# Altium schematic sheet USB Comms.SchDoc: Ravage - USB Comms
size A4; Address1: Drawn By:; Address2: Dan Visser; DocumentNumber: A; Revision: 0.1-alpha; SheetNumber: 3; SheetTotal: 16
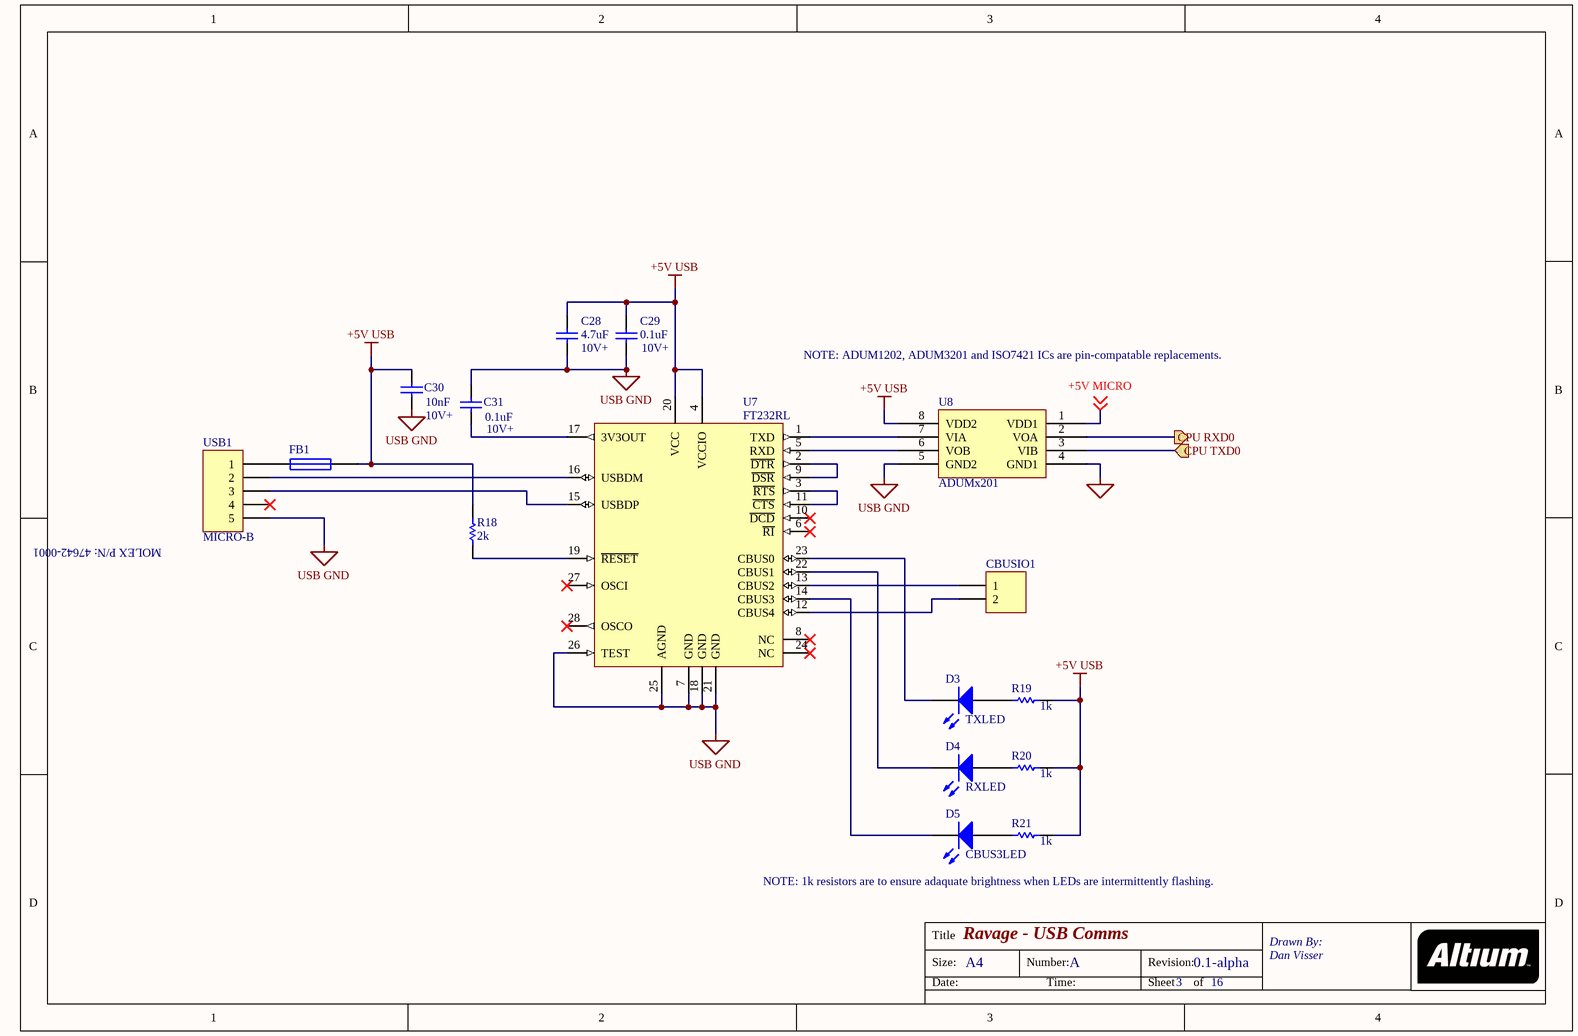
[diagram p0: USB Comms.SchDoc]

## Parts
C28  value 4.7uF  [RAD-0.3]
C29  value 0.1uF  [RAD-0.3]
C30  value 10nF  [RAD-0.3]
C31  value 0.1uF  [RAD-0.3]
CBUSIO1  (no value)  [HDR1X2]
D3  TXLED  [LED-0]
D4  RXLED  [LED-0]
D5  CBUS3LED  [LED-0]
FB1  (no value)  [PIN-W2/E2.8]
R18  value 2k  [AXIAL-0.3]
R19  value 1k  [AXIAL-0.3]
R20  value 1k  [AXIAL-0.3]
R21  value 1k  [AXIAL-0.3]
U7  FT232RL  [SSOP-28_M]
U8  ADUMx201
USB1  MICRO-B  [HDR1X5]

## Ports
CPU RXD0 (out), CPU TXD0 (in)

## Nets
+5V USB: C28.2 C29.2 C30.2 FB1.2 R18.2 R19.2 R20.2 R21.2 U7.4(VCCIO) U7.20(VCC) U8.8(VDD2)
USB GND: C28.1 C29.1 C30.1 C31.2 U7.7(GND) U7.18(GND) U7.21(GND) U7.25(AGND) U7.26(TEST) U8.5(GND2) USB1.5
+5V MICRO: U8.1(VDD1) ; off-sheet +5V MICRO
CPU RXD0: U8.2(VOA) ; port CPU RXD0
CPU TXD0: U8.3(VIB) ; port CPU TXD0
NetC31_1: C31.1 U7.17(3V3OUT)
NetCBUSIO1_1: CBUSIO1.1 U7.13(CBUS2)
NetCBUSIO1_2: CBUSIO1.2 U7.12(CBUS4)
NetD3_1: D3.1(A) R19.1
NetD3_2: D3.2(K) U7.23(CBUS0)
NetD4_1: D4.1(A) R20.1
NetD4_2: D4.2(K) U7.22(CBUS1)
NetD5_1: D5.1(A) R21.1
NetD5_2: D5.2(K) U7.14(CBUS3)
NetR18_1: R18.1 U7.19(~{RESET})
NetU7_1: U7.1(TXD) U8.7(VIA)
NetU7_2: U7.2(~{DTR}) U7.9(~{DSR})
NetU7_3: U7.3(~{RTS}) U7.11(~{CTS})
NetU7_5: U7.5(RXD) U8.6(VOB)
NetU7_15: U7.15(USBDP) USB1.3
NetU7_16: U7.16(USBDM) USB1.2

Not connected (* = marked no-connect by the designer): FB1 1; U7 6(~{RI})* 8(NC)* 10(~{DCD})* 24(NC)* 27(OSCI)* 28(OSCO)*; U8 4(GND1); USB1 1 4*

## Notes on the sheet
- 10V+
- (near C29) 10V+
- NOTE: ADUM1202, ADUM3201 and ISO7421 ICs are pin-compatable replacements.
- (near C31) 10V+
- (near USB1) MOLEX P/N: 47642-0001
- NOTE: 1k resistors are to ensure adaquate brightness when LEDs are intermittently flashing.
- Title
- Size:
- Date:
- A4
- Number:
- Time:
- Revision:
- Sheet
- of

## Library data of the parts
C28-C31 = Cap: Capacitor; Published: 8-Jun-2000; LatestRevisionDate: 17-Jul-2002; LatestRevisionNote: Re-released for DXP Platform.; PackageReference: RAD-0.3; Publisher: Altium Limited; PackageDescription: Radial Cap, Thru-Hole; 2 Leads; 0.3 in Pin Spacing
CBUSIO1 = Header 2: Header, 2-Pin; LatestRevisionDate: 17-Jul-2002; LatestRevisionNote: Re-released for DXP Platform.; Publisher: Altium Limited
D3-D5 = LED0: Typical INFRARED GaAs LED; Published: 8-Jun-2000; LatestRevisionDate: 08-Jul-2005; LatestRevisionNote: Mech Layer 1 removed.; PackageReference: LED-0; Publisher: Altium Limited; PackageDescription: LED; 2 Leads
FB1 = Fuse 1: Published: 8-Jun-2000; LatestRevisionDate: 17-Jul-2002; LatestRevisionNote: Re-released for DXP Platform.; PackageReference: PIN-W2/E2.8; Publisher: Altium Limited; PackageDescription: Thru-Hole; 2 Leads
R18-R21 = Res1: Resistor; Published: 8-Jun-2000; LatestRevisionDate: 17-Jul-2002; LatestRevisionNote: Re-released for DXP Platform.; PackageReference: AXIAL-0.3; Publisher: Altium Limited; PackageDescription: Axial Device, Thru-Hole; 2 Leads; 0.3 in Pin Spacing
U7 = FT232RL-Tray: USB UART Asynchronous Serial Data Transfer Chip, SSOP-28, Tray; Published: 19-Aug-2010; DatasheetVersion: ver 2.07, Jul-2010; PackageVersion: 2010; PackageReference: SSOP-28; Publisher: Altium Limited; PackageDescription: 28-Pin Small Outline Package 0.65 mm Pitch; ComponentLink1Description: Manufacturer Link; ComponentLink1URL: http://www.ftdichip.com/Products/ICs/FT232R.htm; ComponentLink2Description: Datasheet; ComponentLink2URL: http://www.ftdichip.com/Support/Documents/DataSheets/ICs/DS_FT232R.pdf
U8 = ADUM3201
USB1 = Header 5: Header, 5-Pin; LatestRevisionDate: 17-Jul-2002; LatestRevisionNote: Re-released for DXP Platform.; Publisher: Altium Limited